# EAGLE design cnc (EAGLE 9.4.2)

## Sheet 1 of 2
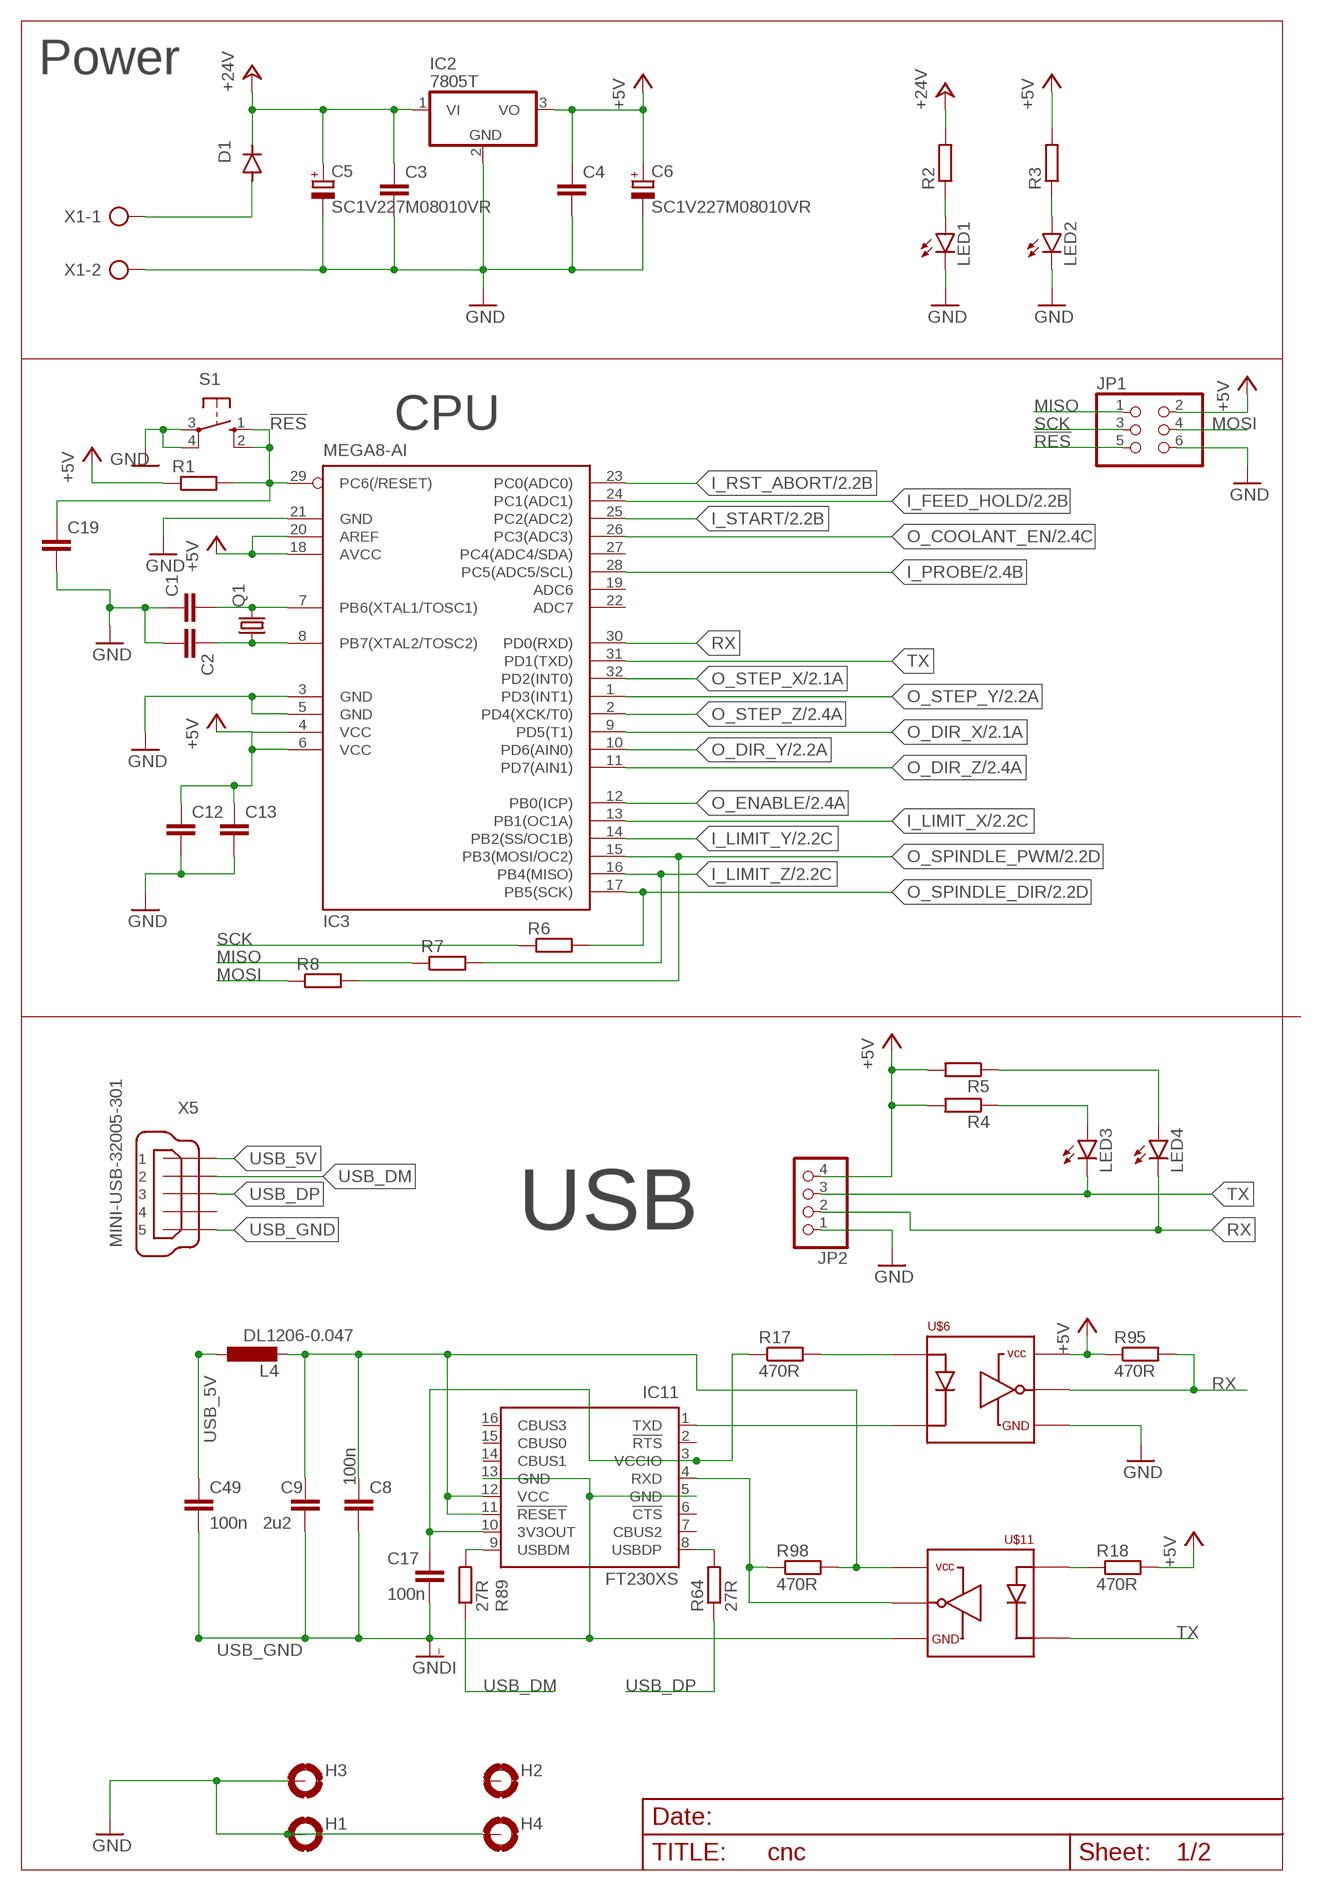
[diagram p0: schematic, sheet 1]

### Parts
C1  C-EUC0603  [C0603]
C2  C-EUC0603  [C0603]
C3  C-EUC0603  [C0603]
C4  C-EUC0603  [C0603]
C5  SC1V227M08010VR  CPOL-EU150CLZ-0810  [150CLZ-0810]
C6  SC1V227M08010VR  CPOL-EU150CLZ-0810  [150CLZ-0810]
C8  100n  C-EUC0603  [C0603]
C9  2u2  C-EUC0603  [C0603]
C12  C-EUC0603  [C0603]
C13  C-EUC0603  [C0603]
C17  100n  C-EUC0603  [C0603]
C19  C-EUC0603  [C0603]
C49  100n  C-EUC0603  [C0603]
D1  DIODE-DO-214AC  [DO-214AC]
H1  MOUNT-PAD-ROUND3.0  [3,0-PAD]
H2  MOUNT-PAD-ROUND3.0  [3,0-PAD]
H3  MOUNT-PAD-ROUND3.0  [3,0-PAD]
H4  MOUNT-PAD-ROUND3.0  [3,0-PAD]
IC2  7805T  [TO220H]
IC3  MEGA8-AI  [TQFP32-08]
IC11  FT230XS  [SSOP16]
JP1  PINHD-2X3  [2X03]
JP2  PINHD-1X4  [1X04]
L4  DL1206-0.047  L-EUL3225P  [L3225P]
LED1  LEDCHIPLED_0805  [CHIPLED_0805]
LED2  LEDCHIPLED_0805  [CHIPLED_0805]
LED3  LEDCHIPLED_0603  [CHIPLED_0603]
LED4  LEDCHIPLED_0603  [CHIPLED_0603]
Q1  CRYSTALHC49S  [HC49/S]
R1  R-EU_R0603  [R0603]
R2  R-EU_R0603  [R0603]
R3  R-EU_R0603  [R0603]
R4  R-EU_R0603  [R0603]
R5  R-EU_R0603  [R0603]
R6  R-EU_R0603  [R0603]
R7  R-EU_R0603  [R0603]
R8  R-EU_R0603  [R0603]
R17  470R  R-EU_R0603  [R0603]
R18  470R  R-EU_R0603  [R0603]
R64  27R  R-EU_R0603  [R0603]
R89  27R  R-EU_R0603  [R0603]
R95  470R  R-EU_R0603  [R0603]
R98  470R  R-EU_R0603  [R0603]
S1  10-XX  [B3F-10XX]
U$6  TLP2362  TPL2362  [SO-6]
U$11  TLP2362  TPL2362  [SO-6]
X1  AK500/2  [AK500/2]
X5  MINI-USB-32005-301  [32005-301]

### Nets
!RES: C19.1 IC3.29(PC6(/RESET)) JP1.5 R1.2 S1.1(S) S1.2(S1)
+5V: C4.1 C6.+ C12.1 C13.1 IC2.3(VO) IC3.4(VCC) IC3.6(VCC) IC3.18(AVCC) IC3.20(AREF) JP1.2 JP2.4 R1.1 R3.2 R4.2 R5.2 R18.2 R95.1 U$6.6 ; also sheet 2
+24V [hv]: C3.1 C5.+ D1.C IC2.1(VI) R2.2 ; also sheet 2
FHBGVFC [hv]: C8.1 C9.1 IC11.11(!RESET) IC11.12(VCC) L4.2 R98.2 U$11.6
GND: C1.1 C2.2 C3.2 C4.2 C5.- C6.- C12.2 C13.2 C19.2 H1.B3,0(MOUNT) H3.B3,0(MOUNT) H4.B3,0(MOUNT) IC2.2(GND) IC3.3(GND) IC3.5(GND) IC3.21(GND) JP1.6 JP2.1 LED1.C LED2.C S1.3(P) S1.4(P1) U$6.4 X1.2 ; also sheet 2
I_FEED_HOLD: IC3.24(PC1(ADC1)) ; also sheet 2
I_LIMIT_X: IC3.13(PB1(OC1A)) ; also sheet 2
I_LIMIT_Y: IC3.14(PB2(SS/OC1B)) ; also sheet 2
I_LIMIT_Z: IC3.16(PB4(MISO)) R7.2 ; also sheet 2
I_PROBE: IC3.28(PC5(ADC5/SCL)) ; also sheet 2
I_RST_ABORT: IC3.23(PC0(ADC0)) ; also sheet 2
I_START: IC3.25(PC2(ADC2)) ; also sheet 2
MISO: JP1.1 R7.1
MOSI: JP1.4 R8.1
N$1 [hv]: D1.A X1.1
N$3: LED1.A R2.1
N$4: LED2.A R3.1
N$7: LED3.A R4.1
N$8: LED4.A R5.1
N$25: C1.2 IC3.7(PB6(XTAL1/TOSC1)) Q1.2
N$26: C2.1 IC3.8(PB7(XTAL2/TOSC2)) Q1.1
N$43: C17.1 IC11.3(VCCIO) IC11.10(3V3OUT) R17.1
N$44: IC11.1(TXD) U$6.3
N$63: IC11.9(USBDM) R89.2
N$70: IC11.8(USBDP) R64.2
N$74 [hv]: R17.2 U$6.1
N$75 [hv]: IC11.4(RXD) R98.1 U$11.5
N$76: R18.1 U$11.1
O_COOLANT_EN: IC3.26(PC3(ADC3)) ; also sheet 2
O_DIR_X: IC3.9(PD5(T1)) ; also sheet 2
O_DIR_Y: IC3.10(PD6(AIN0)) ; also sheet 2
O_DIR_Z: IC3.11(PD7(AIN1)) ; also sheet 2
O_ENABLE: IC3.12(PB0(ICP)) ; also sheet 2
O_SPINDLE_DIR: IC3.17(PB5(SCK)) R6.2 ; also sheet 2
O_SPINDLE_PWM: IC3.15(PB3(MOSI/OC2)) R8.2 ; also sheet 2
O_STEP_X: IC3.32(PD2(INT0)) ; also sheet 2
O_STEP_Y: IC3.1(PD3(INT1)) ; also sheet 2
O_STEP_Z: IC3.2(PD4(XCK/T0)) ; also sheet 2
RX: IC3.30(PD0(RXD)) JP2.2 LED4.C R95.2 U$6.5
SCK: JP1.3 R6.1
TX: IC3.31(PD1(TXD)) JP2.3 LED3.C U$11.3
USB_5V [hv]: C49.1 L4.1 X5.1
USB_DM [hv]: R89.1 X5.2
USB_DP [hv]: R64.1 X5.3
USB_GND [hv]: C8.2 C9.2 C17.2 C49.2 IC11.5(GND) IC11.13(GND) U$11.4 X5.5 ; supply symbol labelled GNDI
Unconnected: H2.B3,0(MOUNT) IC3.19(ADC6) IC3.22(ADC7) IC3.27(PC4(ADC4/SDA)) IC11.2(!RTS) IC11.6(!CTS) IC11.7(CBUS2) IC11.14(CBUS1) IC11.15(CBUS0) IC11.16(CBUS3) X5.4

### Notes on the sheet
- Power
- CPU
- USB

## Sheet 2 of 2
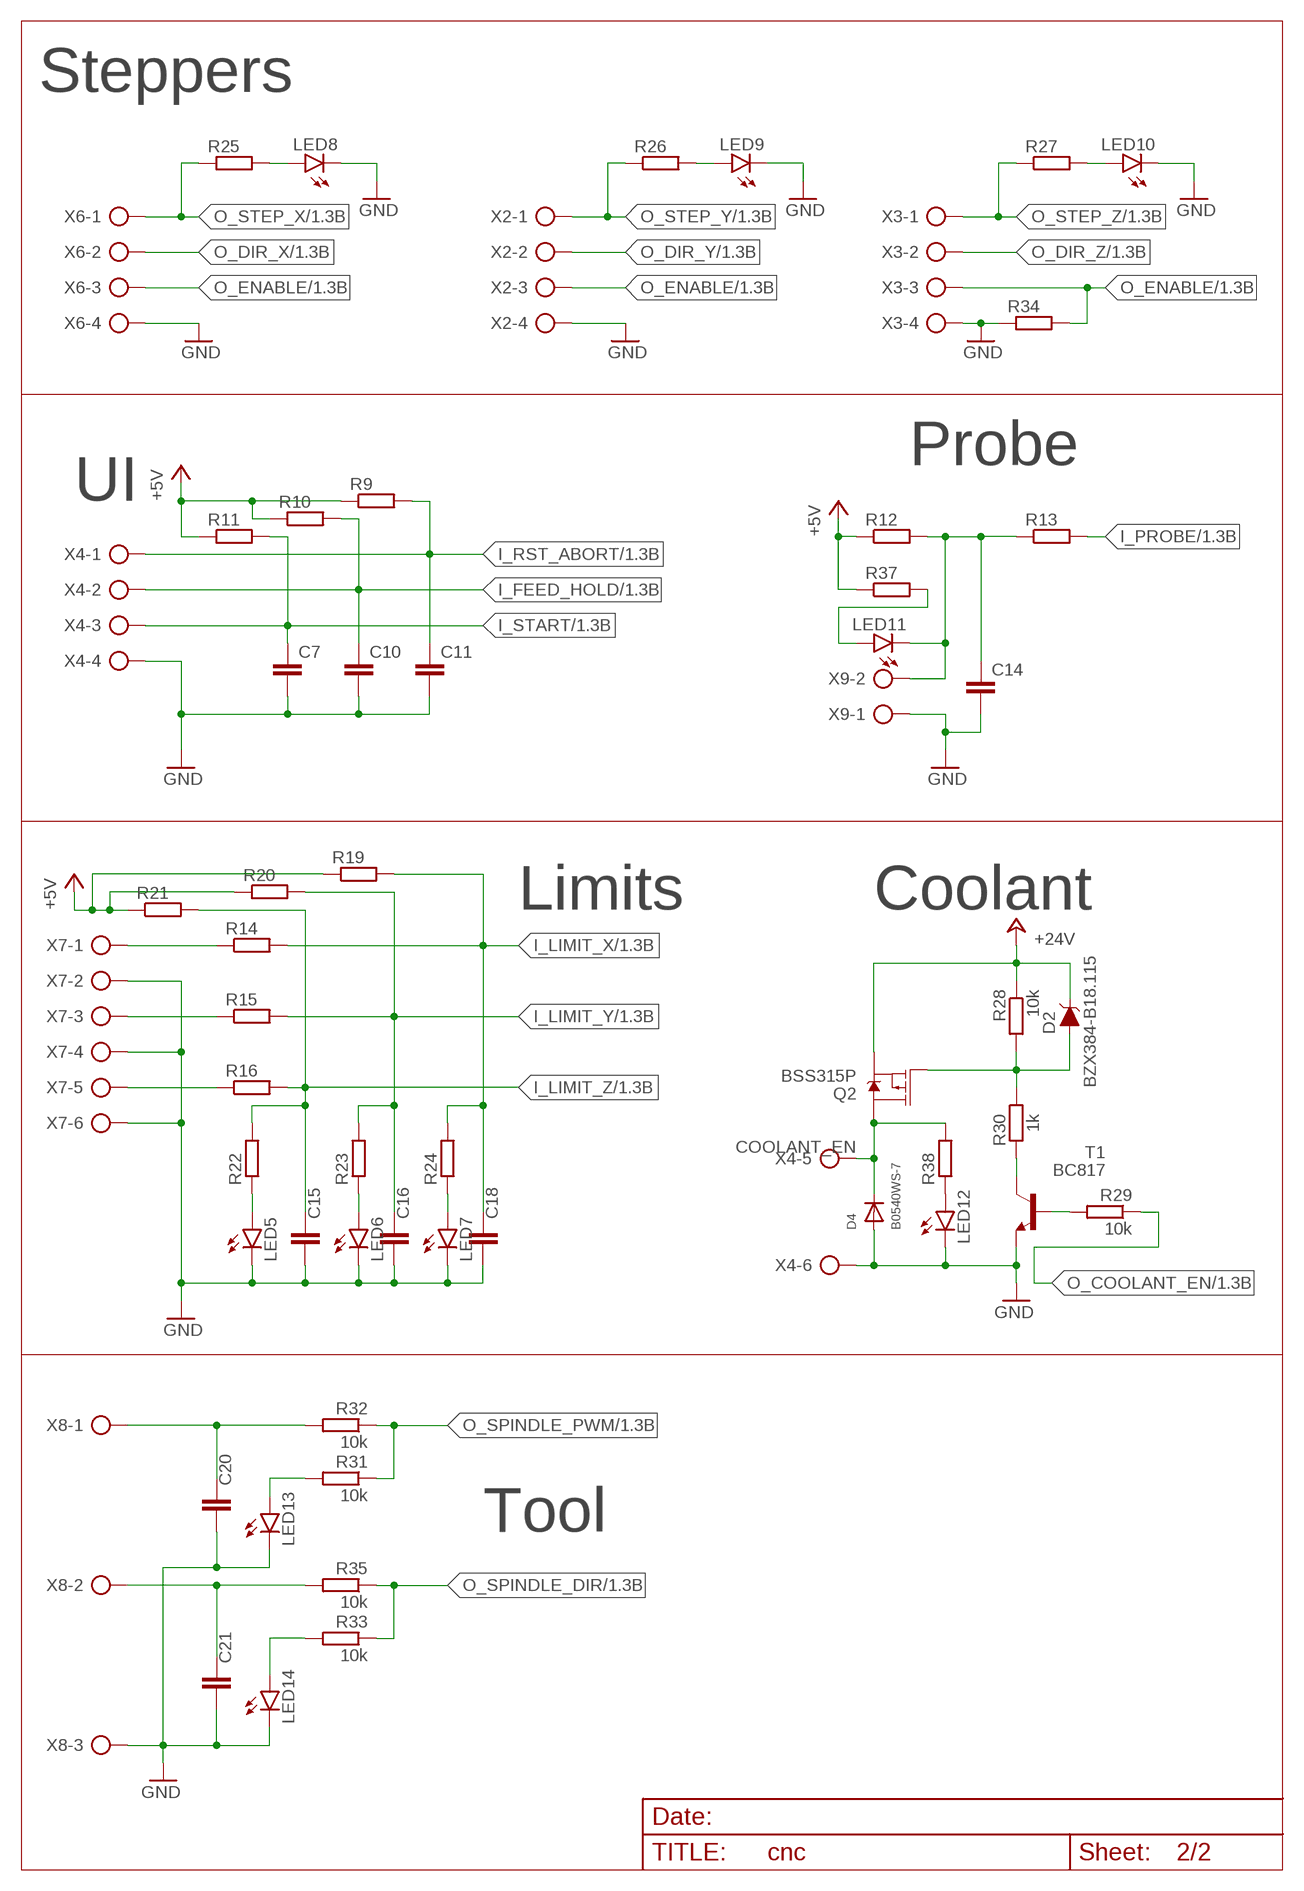
[diagram p1: schematic, sheet 2]

### Parts
C7  C-EUC0603  [C0603]
C10  C-EUC0603  [C0603]
C11  C-EUC0603  [C0603]
C14  C-EUC0603  [C0603]
C15  C-EUC0603  [C0603]
C16  C-EUC0603  [C0603]
C18  C-EUC0603  [C0603]
C20  C-EUC0603  [C0603]
C21  C-EUC0603  [C0603]
D2  BZX384-B18.115  DIODE-ZENER-BZT52C3V6S  [SOD-323]
D4  B0540WS-7  DIODESOD-323F  [SOD-323F]
LED5  LEDCHIPLED_0603  [CHIPLED_0603]
LED6  LEDCHIPLED_0603  [CHIPLED_0603]
LED7  LEDCHIPLED_0603  [CHIPLED_0603]
LED8  LEDCHIPLED_0603  [CHIPLED_0603]
LED9  LEDCHIPLED_0603  [CHIPLED_0603]
LED10  LEDCHIPLED_0603  [CHIPLED_0603]
LED11  LEDCHIPLED_0603  [CHIPLED_0603]
LED12  LEDCHIPLED_0603  [CHIPLED_0603]
LED13  LEDCHIPLED_0603  [CHIPLED_0603]
LED14  LEDCHIPLED_0603  [CHIPLED_0603]
Q2  BSS315P  MOSFET_PCH-DMG2307L  [SOT23-3]
R9  R-EU_R0603  [R0603]
R10  R-EU_R0603  [R0603]
R11  R-EU_R0603  [R0603]
R12  R-EU_R0603  [R0603]
R13  R-EU_R0603  [R0603]
R14  R-EU_R0603  [R0603]
R15  R-EU_R0603  [R0603]
R16  R-EU_R0603  [R0603]
R19  R-EU_R0603  [R0603]
R20  R-EU_R0603  [R0603]
R21  R-EU_R0603  [R0603]
R22  R-EU_R0603  [R0603]
R23  R-EU_R0603  [R0603]
R24  R-EU_R0603  [R0603]
R25  R-EU_R0603  [R0603]
R26  R-EU_R0603  [R0603]
R27  R-EU_R0603  [R0603]
R28  10k  R-EU_R0603  [R0603]
R29  10k  R-EU_R0603  [R0603]
R30  1k  R-EU_R0603  [R0603]
R31  10k  R-EU_R0603  [R0603]
R32  10k  R-EU_R0603  [R0603]
R33  10k  R-EU_R0603  [R0603]
R34  R-EU_R0603  [R0603]
R35  10k  R-EU_R0603  [R0603]
R37  R-EU_R0603  [R0603]
R38  R-EU_R0603  [R0603]
T1  BC817  BC817-16-NPN-SOT23-BEC  [SOT23-BEC]
X2  AK500/4  [AK500/4]
X3  AK500/4  [AK500/4]
X4  AK500/6  [AK500/6]
X6  AK500/4  [AK500/4]
X7  AK500/6  [AK500/6]
X8  AK500/3  [AK500/3]
X9  AK500/2  [AK500/2]

### Nets
+5V: R9.1 R10.1 R11.1 R12.1 R19.1 R20.1 R21.1 R37.1 ; also sheet 1
+24V [hv]: D2.C Q2.2(S) R28.1 ; also sheet 1
COOLANT_EN [hv]: D4.C Q2.3(D) R38.2 X4.5
GND: C7.2 C10.2 C11.2 C14.2 C15.2 C16.2 C18.2 C20.2 C21.2 D4.A LED5.C LED6.C LED7.C LED8.C LED9.C LED10.C LED12.C LED13.C LED14.C R34.1 T1.E X2.4 X3.4 X4.4 X4.6 X6.4 X7.2 X7.4 X7.6 X8.3 X9.1 ; also sheet 1
I_FEED_HOLD: C10.1 R10.2 X4.2 ; also sheet 1
I_LIMIT_X: C18.1 R14.2 R19.2 R24.2 ; also sheet 1
I_LIMIT_Y: C16.1 R15.2 R20.2 R23.2 ; also sheet 1
I_LIMIT_Z: C15.1 R16.2 R21.2 R22.2 ; also sheet 1
I_PROBE: R13.2 ; also sheet 1
I_RST_ABORT: C11.1 R9.2 X4.1 ; also sheet 1
I_START: C7.1 R11.2 X4.3 ; also sheet 1
N$2: C14.1 LED11.C R12.2 R13.1 X9.2
N$5: R16.1 X7.5
N$6: R15.1 X7.3
N$9: R14.1 X7.1
N$10: LED8.A R25.2
N$11: LED5.A R22.1
N$12: R30.2 T1.C
N$13: LED6.A R23.1
N$14: LED9.A R26.2
N$15: LED7.A R24.1
N$16: LED14.A R33.2
N$17: LED13.A R31.2
N$18: LED10.A R27.2
N$20: C20.1 R32.2 X8.1
N$21: C21.1 R35.2 X8.2
N$23: LED11.A R37.2
N$24: LED12.A R38.1
N$56: D2.A Q2.1(G) R28.2 R30.1
N$57: R29.2 T1.B
O_COOLANT_EN: R29.1 ; also sheet 1
O_DIR_X: X6.2 ; also sheet 1
O_DIR_Y: X2.2 ; also sheet 1
O_DIR_Z: X3.2 ; also sheet 1
O_ENABLE: R34.2 X2.3 X3.3 X6.3 ; also sheet 1
O_SPINDLE_DIR: R33.1 R35.1 ; also sheet 1
O_SPINDLE_PWM: R31.1 R32.1 ; also sheet 1
O_STEP_X: R25.1 X6.1 ; also sheet 1
O_STEP_Y: R26.1 X2.1 ; also sheet 1
O_STEP_Z: R27.1 X3.1 ; also sheet 1

### Notes on the sheet
- Steppers
- Probe
- UI
- Limits | Coolant
- Tool

## Library data of the parts
C1-C4 C7 C10-C16 C18-C21 = rcl:C-EU: CAPACITOR, European symbol; SPICEPREFIX: C
C5 C6 = rcl:CPOL-EU: POLARIZED CAPACITOR, European symbol; SPICEPREFIX: C
C8 C9 C17 C49 = rcl:C-EU: CAPACITOR, European symbol
D1 = diode:DIODE-: DIODE
D2 = SparkFun-DiscreteSemi:DIODE-ZENER: Zener Diode A Zener diode allows current to flow from its anode to its cathode like a normal semiconductor diode, but it also permits current to flow in the reverse direction when its "Zener voltage" is reached. - WIkipedia; PROD_ID: DIO-08199; VALUE: 3.6V
D4 = adafruit:DIODE: Diode SMADIODE - SMA Surface Mount Package 20V 1A Schottky Diode Digikey: 641-1014-6-ND DO-1N4148 - Through Hole Small Current Diode SOD-123 20V 1 A (.5mV Vf) Schottky Diode - Digikey: MBRX120TPMSCT-ND SOD-323 10V 570mA (.38mV Vf, 3ns) Schottky Diode - Digikey: ZLLS410CT-ND SOD-523 30V 30mA Schottky Diode (RB751S-40TE61) - Digikey: RB751S-40TE61CT-ND SOT23-R/W - SOT23 Package (R = Solder Paste/Reflow Ovens, W = Hand-Soldering) BAT54Film 40V 300mA - Digikey: 497-7162-1-ND
H1-H4 = holes:MOUNT-PAD-ROUND: MOUNTING PAD, round
IC2 = adafruit:78*: Positive VOLTAGE REGULATOR Added bigger pads to the TO-92 package
IC3 = atmel:MEGA8: MICROCONTROLLER 8 Kbytes FLASH, 1 kbytes SRAM, 512 bytes EEPROM, USART, 6-channel 10 bit ADC, 2-channel 8 bit ADC Pin compatible with Atmega48, ATMega88, ATMega168 Source: avr.lbr; MPN: ATMEGA8-16AU; OC_FARNELL: 9171371; OC_NEWARK: 73M8863
IC11 = ftdichip:FT230X: USB to BASIC UART IC Auto generated by make-symbol-device-package-bsdl.ulp Rev. 43 Source: Data sheet <http://www.ftdichip.com/Support/Documents/DataSheets/ICs/DS_FT230X.pdf>
JP1 = pinhead:PINHD-2X3: PIN HEADER
JP2 = pinhead:PINHD-1X4: PIN HEADER
L4 = rcl:L-EU: INDUCTOR, European symbol
LED1-LED14 = led:LED: LED OSRAM: - CHIPLED LG R971, LG N971, LY N971, LG Q971, LY Q971, LO R971, LY R971 LH N974, LH R974 LS Q976, LO Q976, LY Q976 LO Q996 - Hyper CHIPLED LW Q18S LB Q993, LB Q99A, LB R99A - SideLED LS A670, LO A670, LY A670, LG A670, LP A670 LB A673, LV A673, LT A673, LW A673 LH A674 LY A675 LS A676, LA A676, LO A676, LY A676, LW A676 LS A679, LY A679, LG A679 - Hyper Micro SIDELED® LS Y876, LA Y876, LO Y876, LY Y876 LT Y87S - SmartLED LW L88C, LW L88S LB L89C, LB L89S, LG L890 LS L89K, LO L89K, LY L89K LS L896, LA L896, LO L896, LY L896 - TOPLED LS T670, LO T670, LY T670, LG T670, LP T670 LSG T670, LSP T670, LSY T670, LOP T670, LYG T670 LG T671, LOG T671, LSG T671 LB T673, LV T673, LT T673, LW T673 LH T674 LS T676, LA T676, LO T676, LY T676, LB T676, LH T676, LSB T676, LW T676 LB T67C, LV T67C, LT T67C, LS T67K, LO T67K, LY T67K, LW E67C LS E67B, LA E67B, LO E67B, LY E67B, LB E67C, LV E67C, LT E67C LW T67C LS T679, LY T679, LG T679 LS T770, LO T770, LY T770, LG T770, LP T770 LB T773, LV T773, LT T773, LW T773 LH T774 LS E675, LA E675, LY E675, LS T675 LS T776, LA T776, LO T776, LY T776, LB T776 LHGB T686 LT T68C, LB T68C - Hyper Mini TOPLED® LB M676 - Mini TOPLED Santana® LG M470 LS M47K, LO M47K, LY M47K Source: http://www.osram.convergy.de LUXEON: - LUMILED® LXK2-PW12-R00, LXK2-PW12-S00, LXK2-PW14-U00, LXK2-PW14-V00 LXK2-PM12-R00, LXK2-PM12-S00, LXK2-PM14-U00 LXK2-PE12-Q00, LXK2-PE12-R00, LXK2-PE12-S00, LXK2-PE14-T00, LXK2-PE14-U00 LXK2-PB12-K00, LXK2-PB12-L00, LXK2-PB12-M00, LXK2-PB14-N00, LXK2-PB14-P00, LXK2-PB14-Q00 LXK2-PR12-L00, LXK2-PR12-M00, LXK2-PR14-Q00, LXK2-PR14-R00 LXK2-PD12-Q00, LXK2-PD12-R00, LXK2-PD12-S00 LXK2-PH12-R00, LXK2-PH12-S00 LXK2-PL12-P00, LXK2-PL12-Q00, LXK2-PL12-R00 Source: www.luxeon.com KINGBRIGHT: KA-3528ASYC Source: www.kingbright.com
Q1 = crystal:CRYSTAL: CRYSTAL; OC_FARNELL: 1667008; OC_NEWARK: unknown
Q2 = SparkFun-DiscreteSemi:MOSFET_PCH: P-channel MOSFETs Voltage controlled devices that allow control of high current outputs. SparkFun Products: SparkFun ESP32 Thing <https://www.sparkfun.com/products/13907> SparkFun ESP8266 Thing <https://www.sparkfun.com/products/13231>; PROD_ID: TRANS-11308; VALUE: 2.5A/30V/105mΩ
R1-R16 R19-R27 R34 R37 R38 = rcl:R-EU_: RESISTOR, European symbol; SPICEPREFIX: R
R17 R18 R28-R33 R35 R64 R89 R95 R98 = rcl:R-EU_: RESISTOR, European symbol
S1 = switch-omron:10-XX: OMRON SWITCH; MPN: B3F-1000; OC_FARNELL: 176432; OC_NEWARK: 36M3542
T1 = transistor:*-NPN-: NPN Transistror BF959 corrected 2008.03.06
U$6 U$11 = TLP2362:TPL2362
X1 X9 = con-ptr500:AK500/2: CONNECTOR; OC_FARNELL: unknown; OC_NEWARK: unknown
X2 X3 X6 = con-ptr500:AK500/4: CONNECTOR; OC_FARNELL: unknown; OC_NEWARK: unknown
X4 X7 = con-ptr500:AK500/6: CONNECTOR; OC_FARNELL: unknown; OC_NEWARK: unknown
X5 = con-cypressindustries:MINI-USB-: MINI USB-B Conector Source: www.cypressindustries.com; OC_FARNELL: unknown; OC_NEWARK: unknown
X8 = con-ptr500:AK500/3: CONNECTOR; OC_FARNELL: unknown; OC_NEWARK: unknown

## Net classes
1 hv: clearance 0.33 mm

## Board
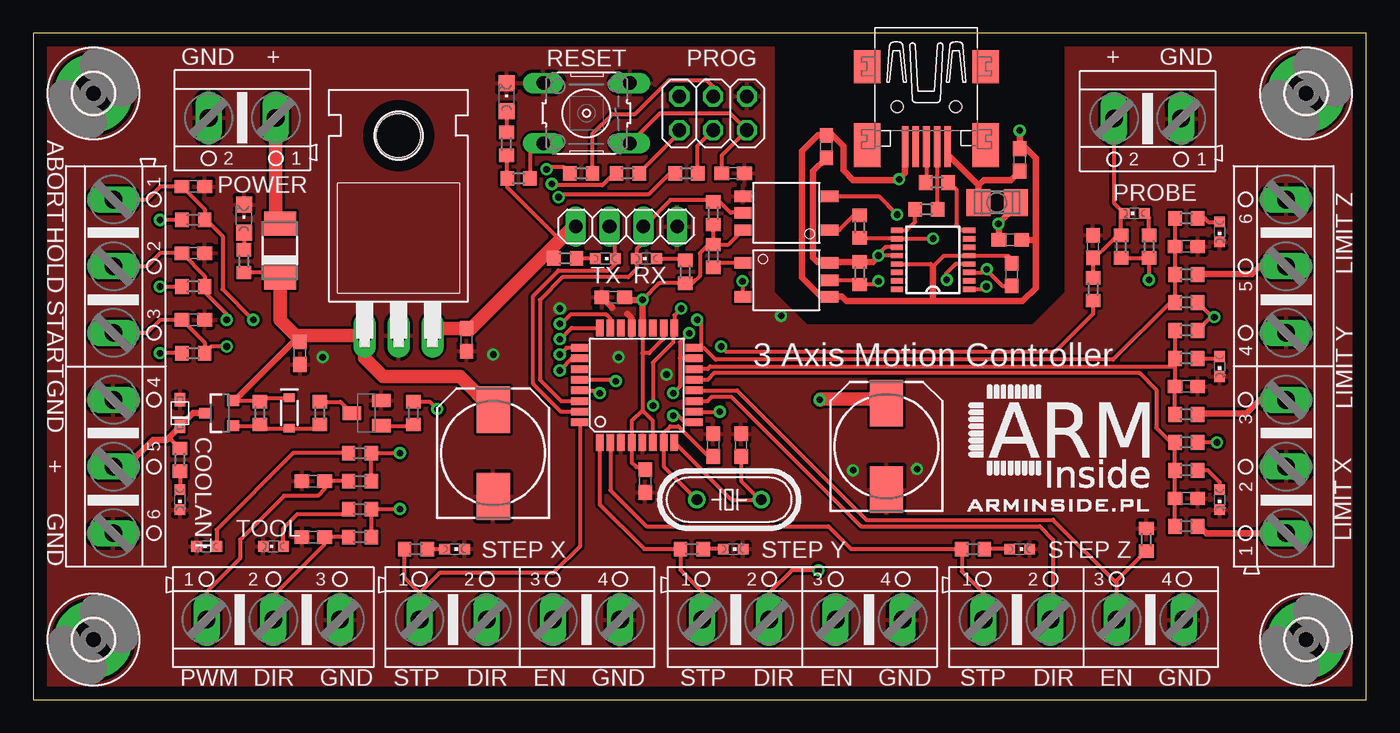
[diagram p2: board, top side]
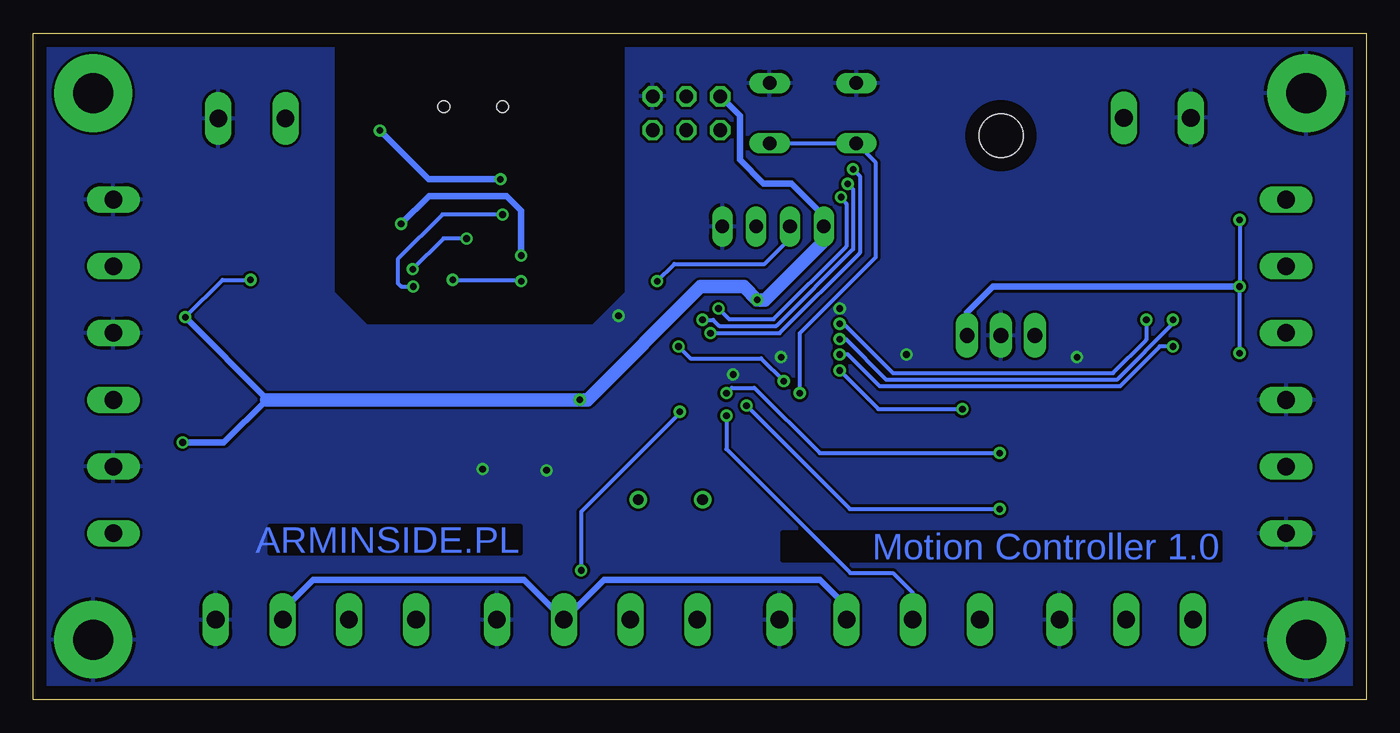
[diagram p3: board, bottom side, seen from below]

Size 100 x 50 mm. Coordinates in mm from the lower left corner, seen from the top.
Outline: 0,0 100,0 100,50 0,50 0,0
Copper layers (1*16): Top 0.035mm / dielectric 1.5mm / Bottom 0.035mm
Design rules "default *": minimum track width 6mil, minimum drill 0.35mm, track to track 0.2mm, track to pad 0.2mm, pad to pad 0.2mm, via to via 0.2mm, smd to smd 0.2mm, copper to edge 40mil, drill to drill 6mil, minimum pad ring 10mil, minimum via ring 8mil, stop-mask expansion 4mil, vias tented up to drill 0.7mm, thermal gap 10mil

### Footprints (pad centres in the part's own frame; a part is rotated, then mirrored left to right if it is on the bottom)
C0603 = smd 1.1 x 1: 1 -0.85,0; 2 0.85,0
150CLZ-0810 = smd 3.5 x 2.5: + 3.25,0; - -3.25,0
DO-214AC = smd 1.8 x 2.4: A 2.025,0; C -2.025,0
SOD-323 = smd 0.63 x 0.83: A 1.15,0; C -1.15,0
SOD-323F = smd 1 x 0.8: A -1,0; C 1,0
3,0-PAD = drill 3 pad 5.842: B3,0 0,0
TO220H = drill 1.118 long: 1 -2.54,-10.16; 2 0,-10.16; 3 2.54,-10.16 | hole 3.302: 0,4.826
TQFP32-08 = smd 1.27 x 0.559: 1 -4.293,2.8; 2 -4.293,2; 3 -4.293,1.2; 4 -4.293,0.4; 5 -4.293,-0.4; 6 -4.293,-1.2; 7 -4.293,-2; 8 -4.293,-2.8; 17 4.293,-2.8; 18 4.293,-2; 19 4.293,-1.2; 20 4.293,-0.4; 21 4.293,0.4; 22 4.293,1.2; 23 4.293,2; 24 4.293,2.8 | smd 0.559 x 1.27: 9 -2.8,-4.293; 10 -2,-4.293; 11 -1.2,-4.293; 12 -0.4,-4.293; 13 0.4,-4.293; 14 1.2,-4.293; 15 2,-4.293; 16 2.8,-4.293; 25 2.8,4.293; 26 2,4.293; 27 1.2,4.293; 28 0.4,4.293; 29 -0.4,4.293; 30 -1.2,4.293; 31 -2,4.293; 32 -2.8,4.293
SSOP16 = smd 0.914 x 0.406: 1 -2.718,2.223; 2 -2.718,1.587; 3 -2.718,0.953; 4 -2.718,0.318; 5 -2.718,-0.318; 6 -2.718,-0.953; 7 -2.718,-1.587; 8 -2.718,-2.223; 9 2.718,-2.223; 10 2.718,-1.587; 11 2.718,-0.953; 12 2.718,-0.318; 13 2.718,0.318; 14 2.718,0.953; 15 2.718,1.587; 16 2.718,2.223
2X03 = drill 1.016 octagon: 1 -2.54,-1.27; 2 -2.54,1.27; 3 0,-1.27; 4 0,1.27; 5 2.54,-1.27; 6 2.54,1.27
1X04 = drill 1.016 long: 1 -3.81,0; 2 -1.27,0; 3 1.27,0; 4 3.81,0
L3225P = smd 1.8 x 2: 1 -1.4,0; 2 1.4,0
CHIPLED_0805 = smd 1.2 x 1.2: A 0,-1.05; C 0,1.05
CHIPLED_0603 = smd 0.8 x 0.8: A 0,-0.75; C 0,0.75
HC49/S = drill 0.813: 1 -2.413,0; 2 2.413,0
SOT23-3 = smd 0.8 x 0.9: 1 -0.95,-1; 2 0.95,-1; 3 0,1.1
R0603 = smd 1 x 1.1: 1 -0.85,0; 2 0.85,0
B3F-10XX = drill 1.016 long: 1 -3.251,2.261; 2 3.251,2.261; 3 -3.251,-2.261; 4 3.251,-2.261
SOT23-BEC = smd 1 x 1.4: B -0.95,-1.1; C 0,1.1; E 0.95,-1.1
SO-6 = smd 0.85 x 1.3: 1 -1.27,-3.251; 3 1.27,-3.251; 4 1.27,3.251; 5 0.025,3.251; 6 -1.27,3.251
AK500/2 = drill 1.321 long: 1 -2.515,0; 2 2.515,0
AK500/4 = drill 1.321 long: 1 -7.518,0; 2 -2.489,0; 3 2.489,0; 4 7.518,0
AK500/6 = drill 1.321 long: 1 -12.522,0; 2 -7.518,0; 3 -2.515,0; 4 2.515,0; 5 7.518,0; 6 12.522,0
32005-301 = smd 3.1 x 0.5: 1 3,1.6; 2 3,0.8; 3 3,0; 4 3,-0.8; 5 3,-1.6 | smd 2.5 x 2: M1 -3,-4.45; M2 -3,4.45 | smd 3.3 x 2: M3 2.9,4.45; M4 2.9,-4.45 | hole 0.9: 0,2.2; 0,-2.2
AK500/3 = drill 1.321 long: 1 -5.004,0; 2 0,0; 3 5.004,0

### Placement (x,y rotation side)
C1  51,19.1 270 top
C2  53.1,19.1 90 top
C3  20,26 270 top
C4  32.5,27 270 top
C5  34.5,18.5 90 top
C6  64,19 90 top
C7  12,28.5 0 top
C8  73.3,34.5 0 top
C9  59.5,41.5 90 top
C10  12,33.5 0 top
C11  12,38.5 0 top
C12  43.5,30.2 180 top
C13  45.9,16.4 270 top
C14  79.5,34 90 top
C15  86.5,34 0 top
C16  86.5,23.5 0 top
C17  73.4,31.9 90 top
C18  86.5,15.1 0 top
C19  52.5,39.5 0 top
C20  21,16.4 180 top
C21  21,12.2 180 top
C49  74,40.5 90 top
D1  18.5,33.7 90 top
D2  19.2,21.5 270 top
D4  11,21.5 270 top
H1  95.5,4.5 0 top
H2  95.5,45.5 0 top
H3  4.5,4.5 0 top
H4  4.5,45.5 0 top
IC2  27.4,37.49 0 top
IC3  45.29,23.6 90 top
IC11  67.5,33 180 top
JP1  51,44 0 top
JP2  44.5,35.5 180 top
L4  72.3,37.3 0 top
LED1  15.8,36.1 0 top
LED2  35.5,45.2 0 top
LED3  42.9,33.1 270 top
LED4  46,33.1 90 top
LED5  89,35.1 180 top
LED6  89,25 180 top
LED7  89,15 180 top
LED8  31.6,11.3 270 top
LED9  52.5,11.3 270 top
LED10  74,11.3 270 top
LED11  82.6,36.5 90 top
LED12  11,15 180 top
LED13  13,11.5 90 top
LED14  18,11.5 90 top
Q1  52.2,15 180 top
Q2  14,21.5 90 top
R1  36.4,39.1 0 top
R2  15.8,32.9 270 top
R3  35.5,41.7 270 top
R4  39.9,33.1 180 top
R5  48.9,32.1 270 top
R6  49,39.5 180 top
R7  44.6,39.5 180 top
R8  41.1,39.5 180 top
R9  12,36 0 top
R10  12,31 0 top
R11  12,26 0 top
R12  81.6,34 90 top
R13  79.5,30.8 270 top
R14  86.5,13 180 top
R15  86.5,21.4 180 top
R16  86.5,31.9 180 top
R17  62,35.5 90 top
R18  51,33.3 90 top
R19  86.5,19.3 180 top
R20  86.5,27.7 180 top
R21  86.5,29.8 180 top
R22  86.5,36.1 180 top
R23  86.5,25.6 180 top
R24  86.5,17.2 180 top
R25  28.7,11.3 0 top
R26  49.4,11.3 0 top
R27  70.5,11.3 0 top
R28  17,21.5 270 top
R29  28.5,21.5 270 top
R30  21.5,21.5 90 top
R31  24.5,18.5 180 top
R32  24.5,16.4 180 top
R33  24.5,14.3 180 top
R34  83.5,12 270 top
R35  24.5,12.2 180 top
R37  83.7,34 90 top
R38  11,18 90 top
R64  67.8,38.8 0 top
R89  67,36.8 180 top
R95  51,36.5 90 top
R98  62,32 90 top
S1  41.5,44 180 top
T1  25,21.5 90 top
U$6  56.5,36.5 90 top
U$11  56.5,31.5 270 top
X1  15.67,43.66 180 top
X2  57.7,6 0 top
X3  78.8,6 0 top
X4  6,25 270 top
X5  67,44.5 270 top
X6  36.5,6 0 top
X7  94,25 90 top
X8  18,6 0 top
X9  83.6,43.6 180 top

### Tracks (layer width: path | path; a pad name or v marks a point on that pad's centre or on a via)
!RES  (via drill 0.5)
  Top 0.3: S1.2 37.79,41.74 37.25,41.2 R1.2 | IC3.29 42.3,23.2 v42.5,23 | S1.1 47.01,44 52.27,44 JP1.5 51.65,40.84 C19.1
  Bottom 0.3: v42.5,23 42.5,27.5 36.8,33.2 36.8,40.29 S1.2 S1.1
+5V  (via drill 0.5)
  Top 0.3: R95.1 R18.2 | R9.1 v9.5,36 | v9.5,31 R10.1 | R11.1 v9.5,26 | R3.2 35.5,39.05 | R1.1 35.55,38.45 39.5,34.5 | IC3.20 45.69,26 | 45.69,26 45.69,21.69 | 45.69,21.69 44.89,20.89 IC3.4 44.89,17.81 45.25,17.45 C13.1 | IC3.6 46.49,20.89 45.69,21.69 | IC3.18 47.29,27.09 46.2,26 45.69,26 | R18.2 50.65,34.15 50,33.5 50,31.8 49.45,31.25 R5.2 46.95,31.25 v45.7,30 v45.69,30 | R4.2 38.58,33.58 | R21.1 88.45,28.7 v88.6,28.7 88.35,28.7 R20.1 | v88.8,19.3 R19.1 | R18.2 52.17,34.15 U$6.6 | R12.1 R37.1 v83.7,31.5
  Top 0.5: R1.1 35.5,39.05 | IC3.20 v45.69,30 44.55,30 C12.1 | 38.58,33.58 38.5,33.5
  Top 1: IC2.3 30.46,27.85 C4.1 32.85,27.85 38.5,33.5 39.5,34.5 | JP2.4 40.5,35.5 38.58,33.58 | C6.+ 63.7,22.55 59.05,22.55 v59,22.5
  Bottom 0.3: v9.5,36 v9.5,31 v9.5,26 | v83.7,31.5 85.8,31.5 v88.6,28.7
  Bottom 0.5: JP2.4 40.69,36.29 43.13,38.73 45.22,38.73 47,40.51 47,43.81 JP1.2 | IC2.3 29.94,29.06 28,31 v9.5,31 | v88.8,19.3 85.7,19.3 82.5,22.5 | v88.6,28.7 82.4,22.5
  Bottom 1: JP2.4 40.69,34.41 45.1,30 v45.7,30 46.7,31 49.93,31 58.43,22.5 v59,22.5 82.4,22.5 82.5,22.5
+24V
  Top 0.3: D1.C 18.12,32.05 R2.2 | D2.C 17.3,22.65 R28.1 16.9,22.45 Q2.2
  Top 0.5: Q2.2 15.1,22.45 19.5,26.85 C3.1 19.67,27.18 19.67,27.33
  Top 1: D1.C 18.5,28.5 19.67,27.33 IC2.1 24.86,25.64 26.25,24.25 32,24.25 C5.+
COOLANT_EN
  Top 0.3: R38.2 10.35,19.5 10,19.5
  Top 0.5: Q2.3 12,21.5 D4.C 10,19.5 9,19.5 6.98,17.48 X4.5
FHBGVFC  (via drill 0.5)
  Top 0.3: IC11.12 v63.4,33.32 63.4,33.42 63.94,33.95 IC11.11 | 58.83,32.85 U$11.6
  Top 0.5: v63.4,33.32 63.4,33.25 63,32.85 R98.2 58.83,32.85 58.5,33.18 58.5,39.65 C9.1 | C8.1 72.45,35.65 v72.4,35.7 73.7,37 L4.2
  Bottom 0.5: v63.4,33.32 63.4,36.7 64.5,37.8 70.3,37.8 v72.4,35.7
GND  (via drill 0.5)
  Top 0.5: IC3.21 44.89,28.64 44.58,28.95 | C12.2 43.35,29.5 43.36,29.5 43.43,29.43
  other vias: 56.1,28.8 39.5,29.35 43.9,25.7 61.5,17.2 66.3,17.3 47.5,24.4 34.5,25.9 21.7,25.7
  pour Top: 0,0 100,0 100,50 77.5,50 77.5,30.5 75,28 58,28 55.5,30.5 55.5,50 0,50
  pour Bottom: 0,50 55.5,50 55.5,30.5 58,28 75,28 77.5,30.5 77.5,50 100,50 100,0 0,0
I_FEED_HOLD  (via drill 0.5)
  Top 0.3: X4.2 6.02,32.5 8.5,32.5 9.5,33.5 C10.1 12.85,31.8 R10.2 12.85,30.6 14.5,28.95 v14.5,28.5 | v39.5,27.05 39.55,27.05 40.39,27.89 IC3.24
  Bottom 0.3: v14.5,28.5 14.5,28.21 18.71,24 36,24 39.05,27.05 v39.5,27.05
I_LIMIT_X
  Top 0.3: R14.2 C18.1 R24.2 R19.2 85.35,19.3 84.25,20.4 84.25,23.25 83,24.5 51.08,24.5 50.58,24 IC3.13
I_LIMIT_Y
  Top 0.3: R15.2 C16.1 85.65,25 | IC3.14 50.58,24.8 50.78,25 85.65,25 | R20.2 R23.2 85.65,25
I_LIMIT_Z  (via drill 0.5)
  Top 0.3: v49.8,28.5 50.1,28.2 50.1,26.42 50.08,26.4 | IC3.16 50.08,26.4 | v38.9,38.7 39,38.6 42.7,38.6 43.6,39.5 R7.2 | R22.2 C15.1 R16.2 R21.2 85.3,29.8 81,25.5 51.2,25.5 50.3,26.4 50.08,26.4
  Bottom 0.3: v38.9,38.7 38.5,38.3 38.5,33.8 44.26,28.04 48.54,28.04 49,28.5 v49.8,28.5
I_PROBE  (via drill 0.5)
  Top 0.3: v43.7,23.9 43.6,24 IC3.28 | v51.6,26.5 52,26.1 76.65,26.1 79.5,28.95 R13.2
  Bottom 0.3: v51.6,26.5 50.7,25.6 45.4,25.6 v43.7,23.9
I_RST_ABORT  (via drill 0.5)
  Top 0.3: X4.1 6.02,37.5 8.5,37.5 9.5,38.5 C11.1 12.85,36.8 R9.2 13,36 14.2,34.8 14.2,30.8 v16.5,28.5 | IC3.23 43.29,28.59 42.99,28.89 40.29,28.89 39.6,28.2 v39.5,28.2
  Bottom 0.3: v16.5,28.5 16.5,27 19,24.5 35.5,24.5 39.2,28.2 v39.5,28.2
I_START  (via drill 0.5)
  Top 0.3: X4.3 6.01,27.5 8.5,27.5 9.5,28.5 C7.1 12.85,26.8 R11.2 13.35,26.5 v14.5,26.5 | IC3.25 40,26.4 v39.5,25.9
  Bottom 0.3: v14.5,26.5 15.5,26.5 18.5,23.5 36.5,23.5 38.9,25.9 v39.5,25.9
MISO
  Top 0.3: R7.1 48.46,42.51 JP1.1
MOSI
  Top 0.3: JP1.4 51,46 50.5,46.5 47.7,46.5 45.15,43.95 43.45,43.95 41.95,42.45 R8.1
N$1
  Top 1: D1.A 18.18,36.04 X1.1
N$2
  Top 0.3: X9.2 81.08,37.27 LED11.C 81.6,36.25 R12.2 81.35,34.85 80.25,33.75 C14.1 R13.1
N$3
  Top 0.3: LED1.A R2.1
N$4
  Top 0.3: LED2.A R3.1
N$5
  Top 0.5: X7.5 92,32.52 91.4,31.92 87.37,31.92 R16.1
N$6
  Top 0.5: X7.3 92,22.48 91,21.48 87.44,21.48 R15.1
N$7
  Top 0.3: LED3.A R4.1
N$8
  Top 0.3: LED4.A 48.75,33.1 R5.1
N$9
  Top 0.5: X7.1 88,12.48 87.48,13 R14.1
N$10
  Top 0.3: R25.2 LED8.A
N$11
  Top 0.3: R22.1 87.9,36.1 88.15,35.85 LED5.A
N$12
  Top 0.3: R30.2 23.05,22.35 T1.C
N$13
  Top 0.3: R23.1 88.85,25.6 LED6.A
N$14
  Top 0.3: LED9.A R26.2
N$15
  Top 0.3: LED7.A 89,16.3 88.1,17.2 R24.1
N$16
  Top 0.3: LED14.A 18.75,12.85 19.8,13.9 23.25,13.9 R33.2
N$17
  Top 0.3: LED13.A 13.75,12.75 19.5,18.5 R31.2
N$18
  Top 0.3: LED10.A R27.2
N$20
  Top 0.3: R32.2 C20.1 21.85,15.8 21.35,15.3 18.8,15.3 15.5,12 15.5,10.6 13,8.1 X8.1
N$21
  Top 0.3: R35.2 C21.1 21.85,11.65 18,7.8 X8.2
N$23
  Top 0.3: R37.2 83.7,36.15 LED11.A
N$24
  Top 0.3: R38.1 LED12.A
N$25
  Top 0.3: Q1.2 47.29,17.5 IC3.7 47.29,19.99 47.8,20.5 48.4,20.5 50.65,18.25 C1.2
N$26
  Top 0.3: IC3.8 52.4,15 54.5,15 | 54.5,15 Q1.1 | C2.1 53.1,16.4 54.5,15
N$43  (via drill 0.5)
  Top 0.3: R17.1 62.06,34.59 IC11.10 67.49,34.59 v67.5,34.6 | 71.48,32.25 71.42,32.25 71.22,32.05 IC11.3 | 71.48,32.25 71.5,32.25 72.7,31.05 C17.1 | v71.53,32.3 71.48,32.25
  Bottom 0.3: v71.53,32.3 69.23,34.6 v67.5,34.6
N$44  (via drill 0.5)
  Top 0.3: U$6.3 63.43,37.77 v64.8,36.4 | v71.5,31 71.28,30.78 IC11.1
  Bottom 0.3: v71.5,31 72.4,31 72.65,31.25 72.65,33.05 69.3,36.4 v64.8,36.4
N$56
  Top 0.3: R30.1 21.5,20.5 21.35,20.35 D2.A 17.3,20.35 R28.2 16.9,20.55 Q2.1
N$57
  Top 0.3: T1.B 28.4,20.55 R29.2
N$63
  Top 0.3: IC11.9 65.52,35.22 66.15,35.85 R89.2
N$70
  Top 0.3: IC11.8 69.63,35.22 69.25,35.6 69.25,38.3 R64.2
N$74
  Top 0.3: U$6.1 60.45,35.23 61.57,36.35 R17.2
N$75  (via drill 0.5)
  Top 0.3: U$11.5 61.67,31.48 R98.1 63.15,31.15 v63.4,31.4 | IC11.4 69.18,32.68 68.5,32 68.5,31.53 v68.53,31.5
  Bottom 0.3: v68.53,31.5 63.6,31.5 63.45,31.35 v63.4,31.4
N$76
  Top 0.3: R18.1 51.3,32.75 53.23,32.75 U$11.1
O_COOLANT_EN  (via drill 0.5)
  Top 0.3: IC3.26 40.97,25.63 40.42,25.63 39.5,24.71 v39.5,24.7 | v30.3,21.8 29.75,22.35 R29.1
  Bottom 0.3: v39.5,24.7 36.6,21.8 v30.3,21.8
O_DIR_X  (via drill 0.5)
  Top 0.3: IC3.9 48.9,20.8 48.4,21.3 v48,21.3
  Bottom 0.3: v48,21.3 48,18.8 38.7,9.5 35.51,9.5 34.01,8 X6.2
O_DIR_Y  (via drill 0.5)
  Top 0.3: IC3.10 v51.5,21.6 | v58.9,9.7 56.91,9.7 55.21,8 X2.2
  Bottom 0.3: v51.5,21.6 51.5,21.5 58.9,14.1 v58.9,9.7
O_DIR_Z
  Top 0.3: IC3.11 50.58,22.4 50.88,22.7 52.4,22.7 62.09,13 75.5,13 76.5,12 76.5,6.19 X3.2
O_ENABLE
  Top 0.3: IC3.12 52.8,23.2 62.5,13.5 76.5,13.5 81.29,8.71 | X3.3 81.29,8.71 | 81.29,8.71 81.29,8.94 R34.2
  Bottom 0.5: X6.3 38.99,7 40.99,9 57.19,9 X2.3 63.19,9 79,9 81.29,6.71 X3.3
O_SPINDLE_DIR  (via drill 0.5)
  Top 0.3: R6.2 47.75,39.5 46.15,37.9 39.6,37.9 v39.4,37.7 | v48.6,29.35 48.09,28.84 IC3.17 48,27.8 48,26.8 46.49,25.29 v46.49,22.06 | v27.5,14.3 R33.1 R35.1
  Bottom 0.3: v39.4,37.7 39.4,37.6 39,37.2 39,34.01 44.46,28.55 47.8,28.55 v48.6,29.35 | v46.49,22.06 38.73,14.3 v27.5,14.3
O_SPINDLE_PWM  (via drill 0.5)
  Top 0.3: v38.5,39.8 38.65,39.95 39.8,39.95 R8.2 | v49.2,27.5 48.5,26.8 48.5,25.63 | 48.5,25.63 48.53,25.6 IC3.15 49.55,25.63 48.5,25.63 | 48.5,25.63 48.5,23.5 v48,23 | R31.1 25.5,18.5 | 25.5,18.5 v27.5,18.5 | R32.1 25.35,18.35 25.5,18.5
  Bottom 0.3: v49.2,27.5 44.01,27.5 38,33.51 38,39.3 v38.5,39.8 | v48,23 47.6,23.4 45.9,23.4 41,18.5 v27.5,18.5
O_STEP_X
  Top 0.3: IC3.32 41,11.5 39,9.5 30.48,9.5 28.98,8 | X6.1 28.98,8 | 28.98,8 27.85,9.13 R25.1
O_STEP_Y
  Top 0.3: IC3.1 42.49,14.66 45.85,11.3 R26.1 48.55,9.73 50.18,8.1 X2.1
O_STEP_Z
  Top 0.3: IC3.2 43.29,15.71 46,13 59.65,13 61.35,11.3 R27.1 69.65,9.63 71.28,8 X3.1
RX
  Top 0.3: U$6.5 52.33,36.52 51.5,37.35 R95.2 50.85,37.5 47.8,37.5 45.8,35.5 JP2.2 45.77,34.3 45.27,33.8 45.27,33.12 LED4.C 45.25,32.3 44.65,31.7 39.7,31.7 38,30 38,24 39.6,22.4 IC3.30
SCK
  Top 0.3: JP1.3 49.8,41.53 49.8,39.55 R6.1
TX  (via drill 0.5)
  Top 0.3: JP2.3 43.65,35.08 LED3.C 43.65,32.7 43.15,32.2 39.4,32.2 37.5,30.3 37.5,23.7 39.6,21.6 IC3.31 | U$11.3 53.25,31.35 v53.2,31.4
  Bottom 0.3: v53.2,31.4 51.9,32.7 45.13,32.7 43.23,34.6 JP2.3
USB_5V
  Top 0.5: X5.1 68.6,40.9 70.9,38.6 | L4.1 70.9,38.6 | 70.9,38.6 71.3,39 73.35,39 C49.1
USB_DM
  Top 0.3: R89.1 67.8,36.85 X5.2
USB_DP
  Top 0.3: X5.3 67,38.85
  Top 0.5: 67,38.85 R64.1
USB_GND  (via drill 0.5)
  Top 0.3: C17.2 73.4,33.05 73.13,33.32 IC11.5 68.32,33.32 67.5,32.5 67.32,32.68 IC11.13
  Top 0.5: X5.5 65.4,39.5 v64.95,39.05 64.9,39 61.5,39 60.78,39.72 60.78,41.54 59.97,42.35 C9.2 58.85,42.35 57.67,41.17 57.67,31.66 59.06,30.27 59.71,30.27 U$11.4 60.67,30.23 61,29.9 67.5,29.9 | 67.5,32.5 67.5,29.9 | 75.2,34.5 75.2,30.9 74.2,29.9 67.5,29.9 | 75.2,34.5 75.2,40.65 74.5,41.35 C49.2 v74,42.7 | C8.2 75.2,34.5
  Bottom 0.5: v64.95,39.05 70.35,39.05 v74,42.7

### Text on the board
Bottom: ARMINSIDE.PL | Motion Controller 1.0
tNames: GND | + | RESET | PROG | + | GND | ABORT | POWER | PROBE | HOLD | LIMIT Z | TX | RX | START | 3 Axis Motion Controller | GND | LIMIT Y | COOLANT | + | GND | TOOL | LIMIT X | STEP X | STEP Y | STEP Z | PWM | DIR | GND | STP | DIR | EN | GND | STP | DIR | EN | GND | STP | DIR | EN | GND